# Altium schematic sheet Digital Output.SchDoc
size A4; SheetNumber: 4; SheetTotal: 6
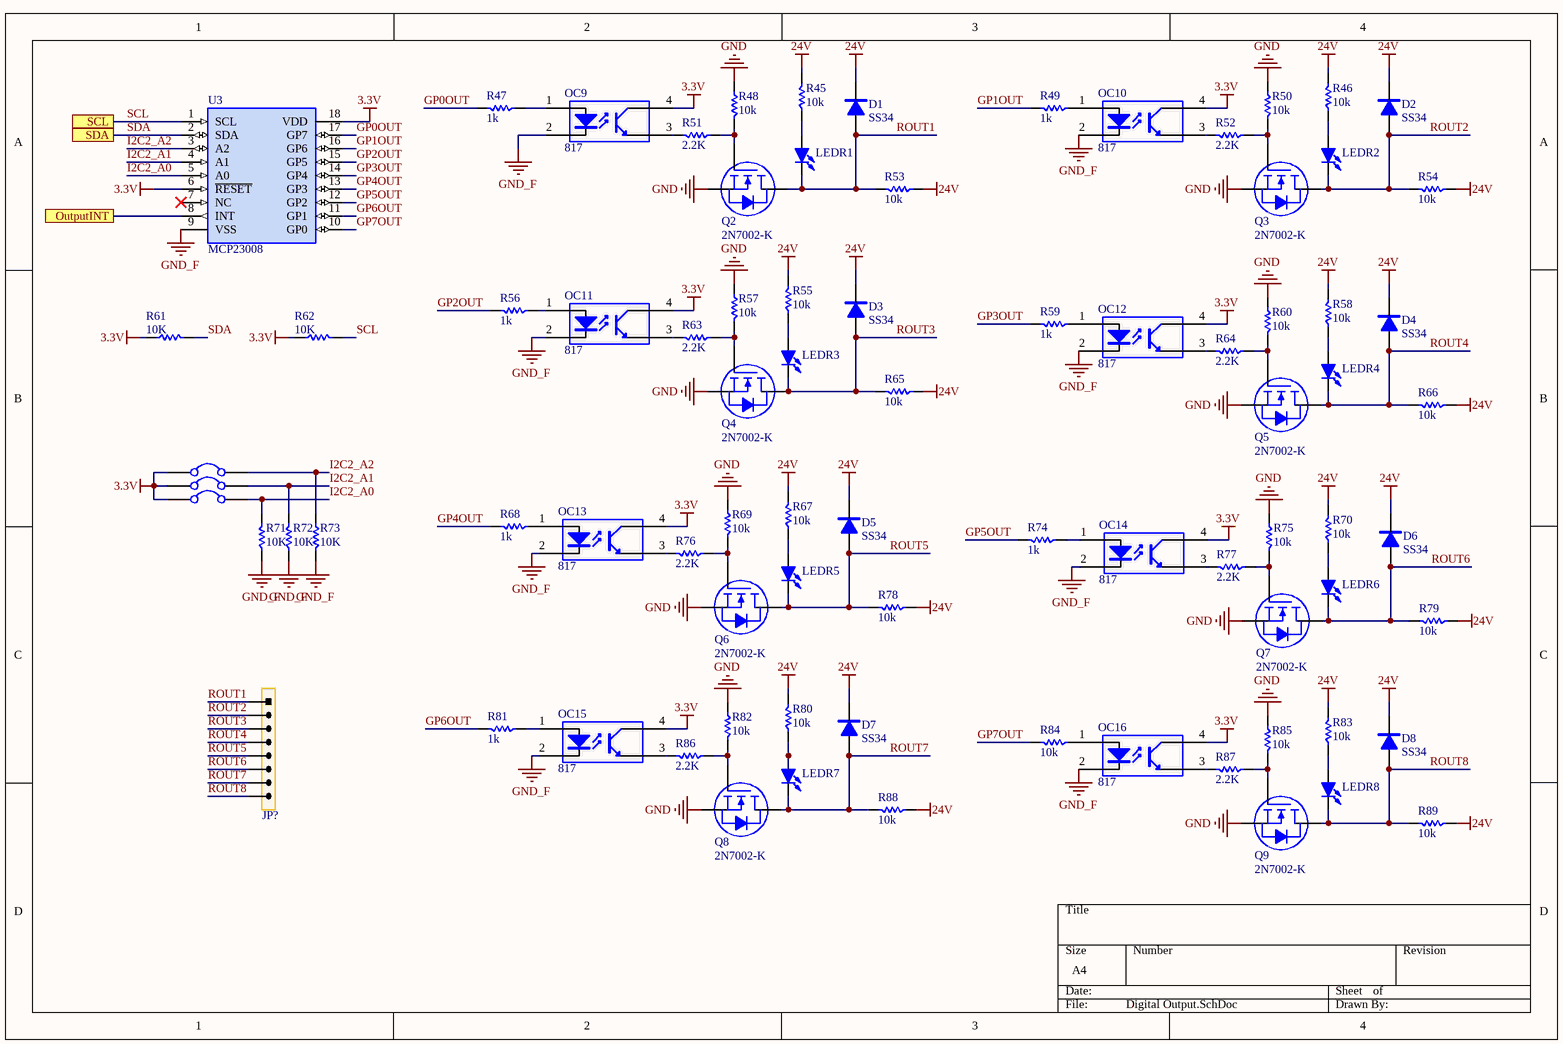
[diagram p0: Digital Output.SchDoc]

## Parts
D1  SS34  [SMA]
D2  SS34  [SMA]
D3  SS34  [SMA]
D4  SS34  [SMA]
D5  SS34  [SMA]
D6  SS34  [SMA]
D7  SS34  [SMA]
D8  SS34  [SMA]
JP?  HDR-1X8  [KF7620-8P]  (value not drawn)
LEDR1  LED-SMD  [LED 0805B]  (value not drawn)
LEDR2  LED-SMD  [LED 0805B]  (value not drawn)
LEDR3  LED-SMD  [LED 0805B]  (value not drawn)
LEDR4  LED-SMD  [LED 0805B]  (value not drawn)
LEDR5  LED-SMD  [LED 0805B]  (value not drawn)
LEDR6  LED-SMD  [LED 0805B]  (value not drawn)
LEDR7  LED-SMD  [LED 0805B]  (value not drawn)
LEDR8  LED-SMD  [LED 0805B]  (value not drawn)
OC9  817  [PC817-SMD]
OC10  817  [PC817-SMD]
OC11  817  [PC817-SMD]
OC12  817  [PC817-SMD]
OC13  817  [PC817-SMD]
OC14  817  [PC817-SMD]
OC15  817  [PC817-SMD]
OC16  817  [PC817-SMD]
Q2  2N7002-K  [SOT23-3L]
Q3  2N7002-K  [SOT23-3L]
Q4  2N7002-K  [SOT23-3L]
Q5  2N7002-K  [SOT23-3L]
Q6  2N7002-K  [SOT23-3L]
Q7  2N7002-K  [SOT23-3L]
Q8  2N7002-K  [SOT23-3L]
Q9  2N7002-K  [SOT23-3L]
R45  10k  [R 0805]
R46  10k  [R 0805]
R47  1k  [R 0805]
R48  10k  [R 0805]
R49  1k  [R 0805]
R50  10k  [R 0805]
R51  2.2K  [R 0805]
R52  2.2K  [R 0805]
R53  10k  [R 0805]
R54  10k  [R 0805]
R55  10k  [R 0805]
R56  1k  [R 0805]
R57  10k  [R 0805]
R58  10k  [R 0805]
R59  1k  [R 0805]
R60  10k  [R 0805]
R61  10K  [R 0805]
R62  10K  [R 0805]
R63  2.2K  [R 0805]
R64  2.2K  [R 0805]
R65  10k  [R 0805]
R66  10k  [R 0805]
R67  10k  [R 0805]
R68  1k  [R 0805]
R69  10k  [R 0805]
R70  10k  [R 0805]
R71  10K  [R 0805]
R72  10K  [R 0805]
R73  10K  [R 0805]
R74  1k  [R 0805]
R75  10k  [R 0805]
R76  2.2K  [R 0805]
R77  2.2K  [R 0805]
R78  10k  [R 0805]
R79  10k  [R 0805]
R80  10k  [R 0805]
R81  1k  [R 0805]
R82  10k  [R 0805]
R83  10k  [R 0805]
R84  10k  [R 0805]
R85  10k  [R 0805]
R86  2.2K  [R 0805]
R87  2.2K  [R 0805]
R88  10k  [R 0805]
R89  10k  [R 0805]
SB4  Solder Bridge  [Solder Bridge Open]  (value not drawn)
SB5  Solder Bridge  [Solder Bridge Open]  (value not drawn)
SB6  Solder Bridge  [Solder Bridge Open]  (value not drawn)
U3  MCP23008  [SOP18W_M]

## Ports
OutputINT, SCL, SDA

## Nets
3.3V: OC9.4(C) OC10.4(C) OC11.4(C) OC12.4(C) OC13.4(C) OC14.4(C) OC15.4(C) OC16.4(C) R61.1 R62.1 SB4.1 SB5.1 SB6.1 U3.6(~{RESET}) U3.18(VDD)
24V: D1.2(K) D2.2(K) D3.2(K) D4.2(K) D5.2(K) D6.2(K) D7.2(K) D8.2(K) R45.2 R46.2 R53.1 R54.1 R55.2 R58.2 R65.1 R66.1 R67.2 R70.2 R78.1 R79.1 R80.2 R83.2 R88.1 R89.1
GND: Q2.2(S) Q3.2(S) Q4.2(S) Q5.2(S) Q6.2(S) Q7.2(S) Q8.2(S) Q9.2(S) R48.1 R50.1 R57.1 R60.1 R69.1 R75.1 R82.1 R85.1
GND_F: OC9.2(K) OC10.2(K) OC11.2(K) OC12.2(K) OC13.2(K) OC14.2(K) OC15.2(K) OC16.2(K) R71.1 R72.1 R73.2 U3.9(VSS)
GP0OUT: R47.2 U3.17(GP7)
GP1OUT: R49.2 U3.16(GP6)
GP2OUT: R56.2 U3.15(GP5)
GP3OUT: R59.2 U3.14(GP4)
GP4OUT: R68.2 U3.13(GP3)
GP5OUT: R74.2 U3.12(GP2)
GP6OUT: R81.2 U3.11(GP1)
GP7OUT: R84.2 U3.10(GP0)
I2C2_A0: R71.2 SB6.2 U3.5(A0)
I2C2_A1: R72.2 SB5.2 U3.4(A1)
I2C2_A2: R73.1 SB4.2 U3.3(A2)
OutputINT: U3.8(INT) ; port OutputINT
ROUT1: D1.1(A) JP?.1 LEDR1.2(K) Q2.3(D) R53.2
ROUT2: D2.1(A) JP?.2 LEDR2.2(K) Q3.3(D) R54.2
ROUT3: D3.1(A) JP?.3 LEDR3.2(K) Q4.3(D) R65.2
ROUT4: D4.1(A) JP?.4 LEDR4.2(K) Q5.3(D) R66.2
ROUT5: D5.1(A) JP?.5 LEDR5.2(K) Q6.3(D) R78.2
ROUT6: D6.1(A) JP?.6 LEDR6.2(K) Q7.3(D) R79.2
ROUT7: D7.1(A) JP?.7 LEDR7.2(K) Q8.3(D) R88.2
ROUT8: D8.1(A) JP?.8 LEDR8.2(K) Q9.3(D) R89.2
SCL: R62.2 U3.1(SCL) ; port SCL
SDA: R61.2 U3.2(SDA) ; port SDA
NetLEDR1_1: LEDR1.1(A) R45.1
NetLEDR2_1: LEDR2.1(A) R46.1
NetLEDR3_1: LEDR3.1(A) R55.1
NetLEDR4_1: LEDR4.1(A) R58.1
NetLEDR5_1: LEDR5.1(A) R67.1
NetLEDR6_1: LEDR6.1(A) R70.1
NetLEDR7_1: LEDR7.1(A) R80.1
NetLEDR8_1: LEDR8.1(A) R83.1
NetOC9_1: OC9.1(A) R47.1
NetOC9_3: OC9.3(E) R51.2
NetOC10_1: OC10.1(A) R49.1
NetOC10_3: OC10.3(E) R52.2
NetOC11_1: OC11.1(A) R56.1
NetOC11_3: OC11.3(E) R63.2
NetOC12_1: OC12.1(A) R59.1
NetOC12_3: OC12.3(E) R64.2
NetOC13_1: OC13.1(A) R68.1
NetOC13_3: OC13.3(E) R76.2
NetOC14_1: OC14.1(A) R74.1
NetOC14_3: OC14.3(E) R77.2
NetOC15_1: OC15.1(A) R81.1
NetOC15_3: OC15.3(E) R86.2
NetOC16_1: OC16.1(A) R84.1
NetOC16_3: OC16.3(E) R87.2
NetQ2_1: Q2.1(G) R48.2 R51.1
NetQ3_1: Q3.1(G) R50.2 R52.1
NetQ4_1: Q4.1(G) R57.2 R63.1
NetQ5_1: Q5.1(G) R60.2 R64.1
NetQ6_1: Q6.1(G) R69.2 R76.1
NetQ7_1: Q7.1(G) R75.2 R77.1
NetQ8_1: Q8.1(G) R82.2 R86.1
NetQ9_1: Q9.1(G) R85.2 R87.1

Not connected (* = marked no-connect by the designer): U3 7(NC)*

## Library data of the parts
D1-D8 = M7: Rectifier diode; BOM名称: 整流二极管; 版权归属: 源创客; 学习资源: www.ooocke.com
JP? = Header 8: 8P Connector; BOM名称: 8P接插件; 版权归属: 源创客; 学习资源: www.ooocke.com
LEDR1-LEDR8 = LED-SMD: Patch LED; BOM名称: 贴片LED; 版权归属: 源创客; 学习资源: www.ooocke.com
OC9-OC16 = 817: AC Input Photocoupler; BOM名称: 线性光耦; 版权归属: 源创客; 学习资源: www.ooocke.com
Q2-Q9 = 2N7002-SMD: N-Channel Enhancement Mode Field Effect Transistor
R45-R89 = R: Chip resistor; 版权归属: 源创客; BOM名称: Chip resistor; 学习资源: www.ooocke.com
U3 = MCP23008: 8 Bit I/O Expander